# EAGLE design testbrd (EAGLE 7.2.0)
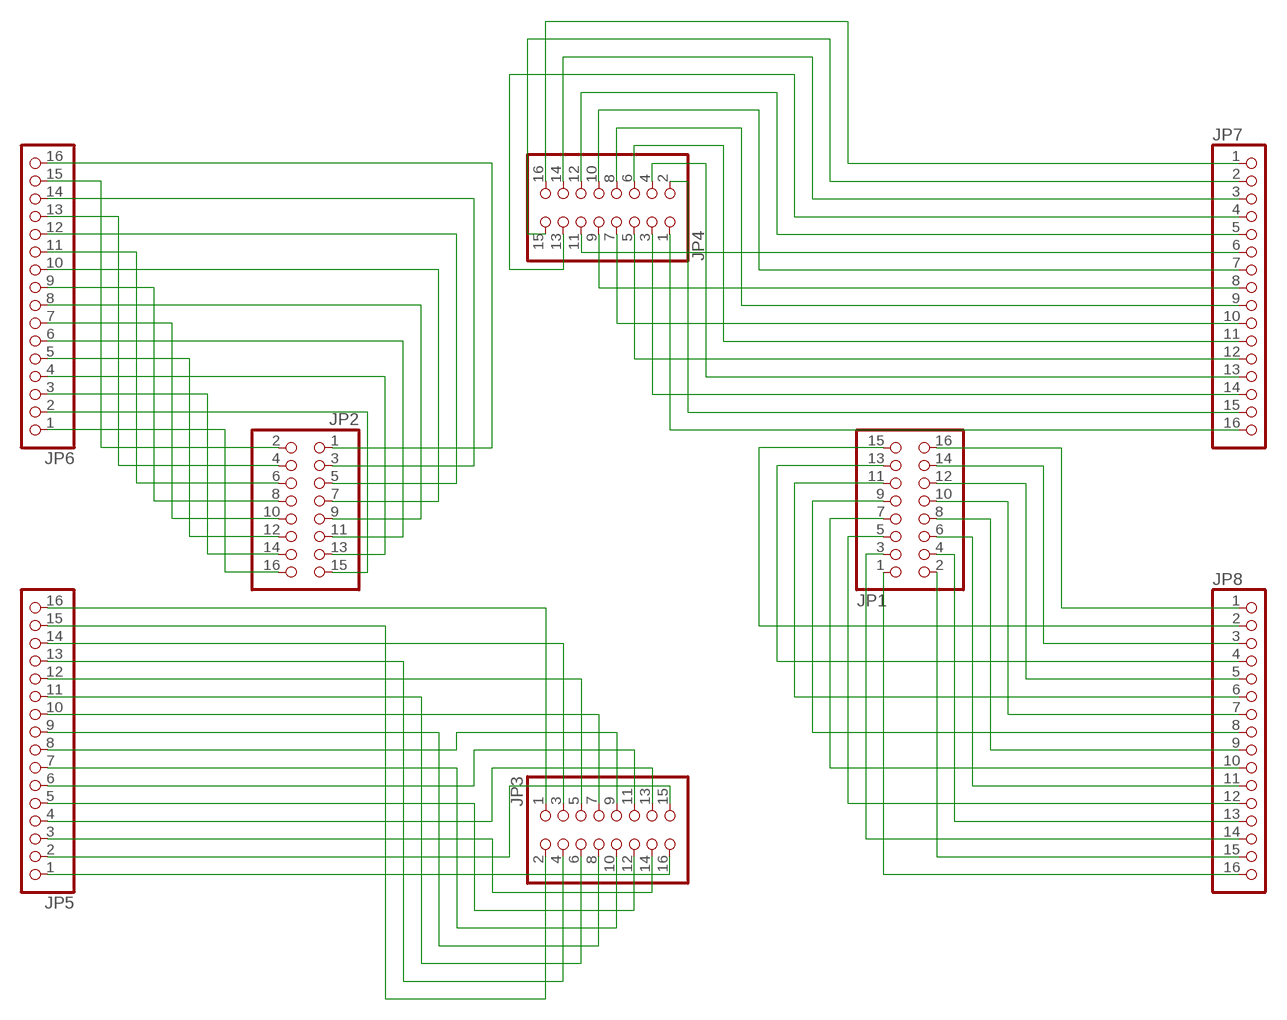
[diagram p0: schematic, sheet 1]

## Parts
JP1  PINHD-2X8  [2X08]
JP2  PINHD-2X8  [2X08]
JP3  PINHD-2X8  [2X08]
JP4  PINHD-2X8  [2X08]
JP5  PINHD-1X16  [1X16]
JP6  PINHD-1X16  [1X16]
JP7  PINHD-1X16  [1X16]
JP8  PINHD-1X16  [1X16]

## Nets
N$1: JP2.16 JP6.1
N$2: JP2.15 JP6.2
N$3: JP2.14 JP6.3
N$4: JP2.13 JP6.4
N$5: JP2.12 JP6.5
N$6: JP2.11 JP6.6
N$7: JP2.10 JP6.7
N$8: JP2.9 JP6.8
N$9: JP2.8 JP6.9
N$10: JP2.7 JP6.10
N$11: JP2.6 JP6.11
N$12: JP2.5 JP6.12
N$13: JP2.4 JP6.13
N$14: JP2.3 JP6.14
N$15: JP2.2 JP6.15
N$16: JP2.1 JP6.16
N$17: JP3.16 JP5.1
N$18: JP3.15 JP5.2
N$19: JP3.14 JP5.3
N$20: JP3.13 JP5.4
N$21: JP3.12 JP5.5
N$22: JP3.11 JP5.6
N$23: JP3.10 JP5.7
N$24: JP3.9 JP5.8
N$25: JP3.8 JP5.9
N$26: JP3.7 JP5.10
N$27: JP3.6 JP5.11
N$28: JP3.5 JP5.12
N$29: JP3.4 JP5.13
N$30: JP3.3 JP5.14
N$31: JP3.2 JP5.15
N$32: JP3.1 JP5.16
N$33: JP1.1 JP8.16
N$34: JP1.2 JP8.15
N$35: JP1.3 JP8.14
N$36: JP1.4 JP8.13
N$37: JP1.5 JP8.12
N$38: JP1.6 JP8.11
N$39: JP1.7 JP8.10
N$40: JP1.8 JP8.9
N$41: JP1.9 JP8.8
N$42: JP1.10 JP8.7
N$43: JP1.11 JP8.6
N$44: JP1.12 JP8.5
N$45: JP1.13 JP8.4
N$46: JP1.14 JP8.3
N$47: JP1.15 JP8.2
N$48: JP1.16 JP8.1
N$49: JP4.1 JP7.16
N$50: JP4.2 JP7.15
N$51: JP4.3 JP7.14
N$52: JP4.4 JP7.13
N$53: JP4.5 JP7.12
N$54: JP4.6 JP7.11
N$55: JP4.7 JP7.10
N$56: JP4.8 JP7.9
N$57: JP4.9 JP7.8
N$58: JP4.10 JP7.7
N$59: JP4.11 JP7.6
N$60: JP4.12 JP7.5
N$61: JP4.13 JP7.4
N$62: JP4.14 JP7.3
N$63: JP4.15 JP7.2
N$64: JP4.16 JP7.1

## Library data of the parts
JP1-JP4 = pinhead:PINHD-2X8: PIN HEADER
JP5-JP8 = pinhead:PINHD-1X16: PIN HEADER

## Board
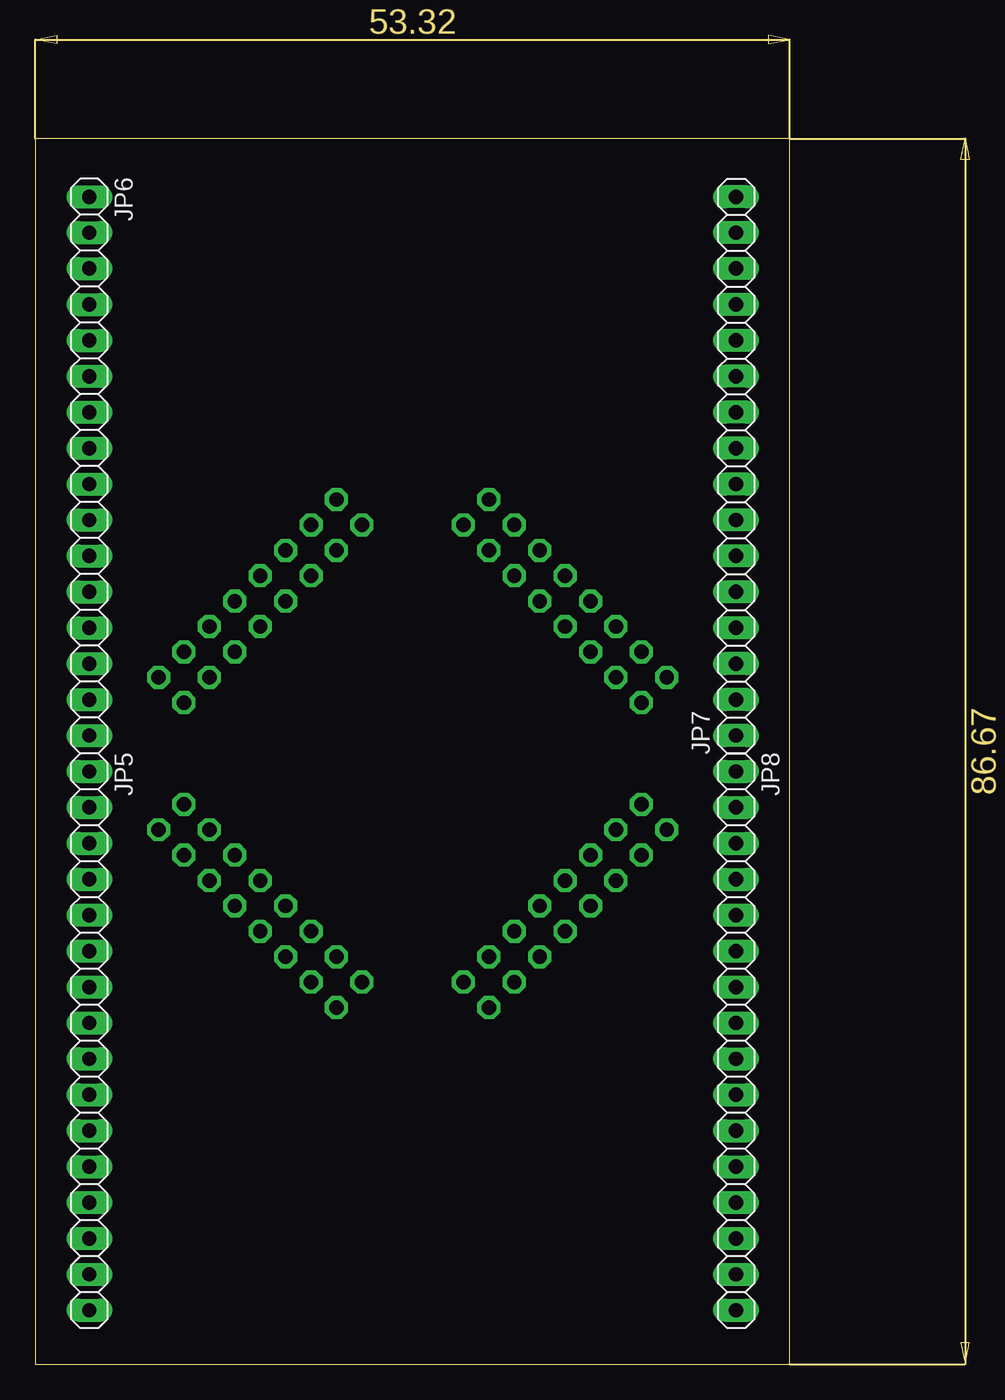
[diagram p1: board, top side]
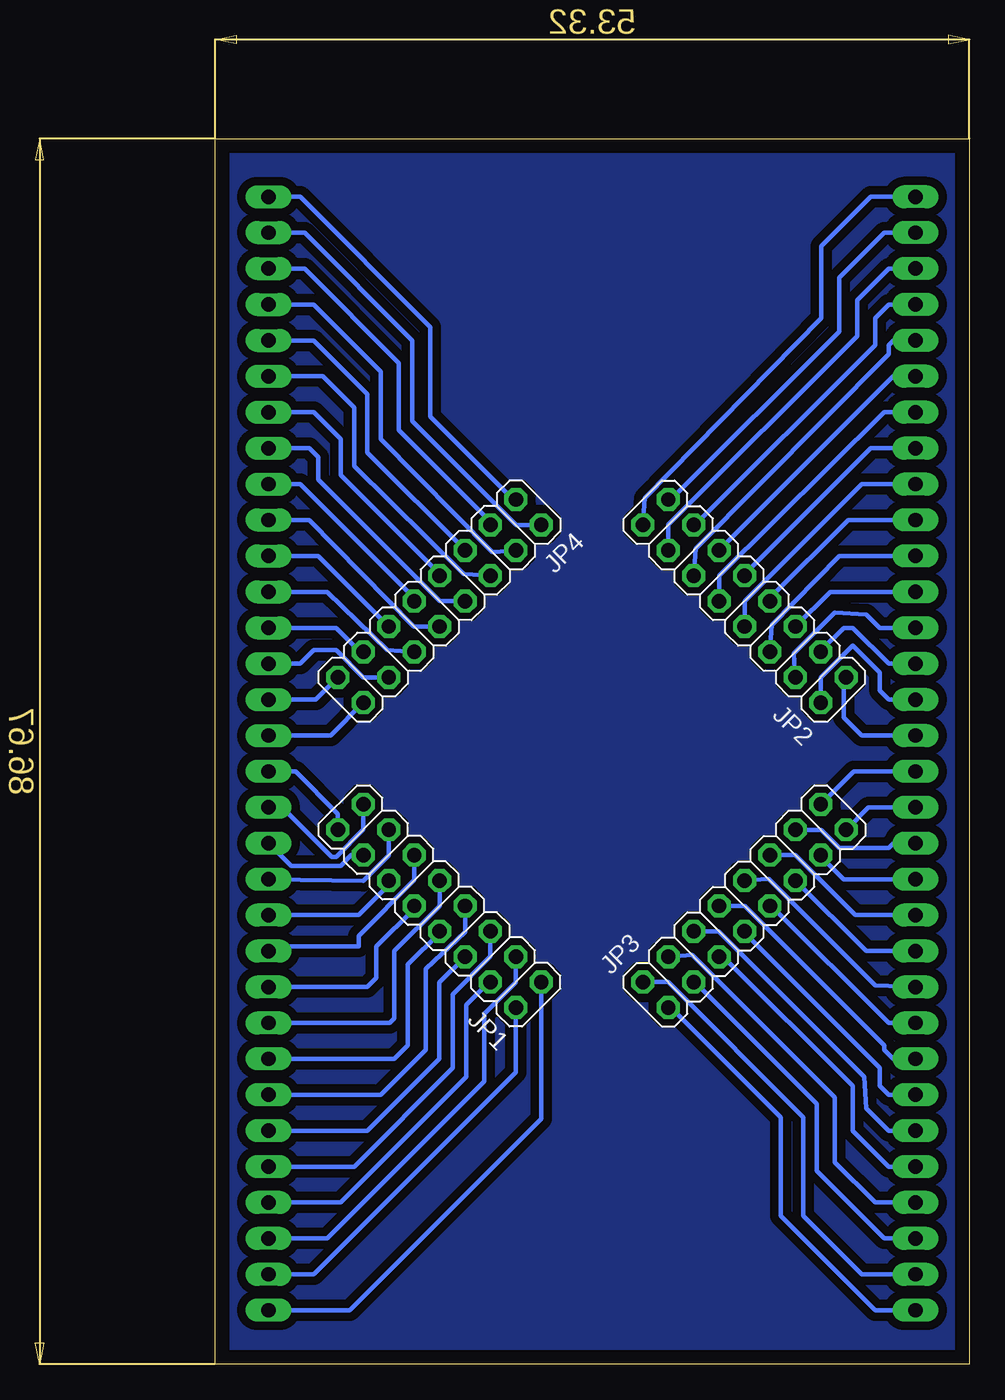
[diagram p2: board, bottom side, seen from below]

Size 53.32 x 86.67 mm. Coordinates in mm from the lower left corner, seen from the top.
Outline: 0,0 53.32,0 53.32,86.67 0,86.67 0,0
Copper layers (1*16): Top 0.035mm / dielectric 1.5mm / Bottom 0.035mm
Design rules "default *": minimum track width 10mil, minimum drill 24mil, track to track 8mil, track to pad 8mil, pad to pad 8mil, via to via 8mil, smd to smd 8mil, copper to edge 40mil, drill to drill 8mil, minimum pad ring 12mil, minimum via ring 8mil, stop-mask expansion 4mil, vias tented up to drill 0mil, thermal gap 10mil

### Footprints (pad centres in the part's own frame; a part is rotated, then mirrored left to right if it is on the bottom)
2X08 = drill 1.016 octagon: 1 -8.89,-1.27; 2 -8.89,1.27; 3 -6.35,-1.27; 4 -6.35,1.27; 5 -3.81,-1.27; 6 -3.81,1.27; 7 -1.27,-1.27; 8 -1.27,1.27; 9 1.27,-1.27; 10 1.27,1.27; 11 3.81,-1.27; 12 3.81,1.27; 13 6.35,-1.27; 14 6.35,1.27; 15 8.89,-1.27; 16 8.89,1.27
1X16 = drill 1.016 long: 1 -19.05,0; 2 -16.51,0; 3 -13.97,0; 4 -11.43,0; 5 -8.89,0; 6 -6.35,0; 7 -3.81,0; 8 -1.27,0; 9 1.27,0; 10 3.81,0; 11 6.35,0; 12 8.89,0; 13 11.43,0; 14 13.97,0; 15 16.51,0; 16 19.05,0

### Placement (x,y rotation side)
JP1  37.45,32.4 135 bottom
JP2  15.89,53.96 135 bottom
JP3  15.89,32.4 45 bottom
JP4  37.45,53.96 225 bottom
JP5  3.81,22.86 270 top
JP6  3.81,63.5 270 top
JP7  49.53,63.5 90 top
JP8  49.53,22.86 270 top

### Tracks (layer width: path | path; a pad name or v marks a point on that pad's centre or on a via)
N$1
  Bottom 0.305: JP2.16 22.95,61.25 10.48,73.98 10.48,79.06 6.99,82.55 JP6.1
N$2
  Bottom 0.305: JP2.15 21.09,61.14 9.21,73.03 9.21,76.83 6.03,80.01 JP6.2
N$3
  Bottom 0.305: JP2.14 21.28,59.36 7.94,72.71 7.94,75.25 5.71,77.47 JP6.3
N$4
  Bottom 0.305: JP2.13 19.4,59.34 6.67,72.07 6.67,73.98 5.71,74.93 JP6.4
N$5
  Bottom 0.305: JP2.12 19.36,57.67 5.71,71.44 5.71,72.07 5.4,72.39 JP6.5
N$6
  Bottom 0.305: JP2.11 5.4,69.85 JP6.6
N$7
  Bottom 0.305: JP2.10 17.69,55.78 6.03,67.31 JP6.7
N$8
  Bottom 0.305: JP2.9 15.89,55.86 6.99,64.77 JP6.8
N$9
  Bottom 0.305: JP2.8 15.89,53.96 7.62,62.23 JP6.9
N$10
  Bottom 0.305: JP2.7 14.1,54.16 8.57,59.69 JP6.10
N$11
  Bottom 0.305: JP2.6 13.97,52.26 9.21,57.15 JP6.11
N$12
  Bottom 0.305: JP2.5 9.84,54.61 JP6.12
N$13
  Bottom 0.305: JP2.4 12.43,50.25 9.53,53.15 7.3,53.02 6.35,52.07 JP6.13
N$14
  Bottom 0.305: JP2.3 10.51,50.45 8.89,52.07 8.26,52.07 5.71,49.53 JP6.14
N$15
  Bottom 0.305: JP2.2 10.51,48.55 8.26,50.8 6.35,48.9 6.35,47.62 5.71,46.99 JP6.15
N$16
  Bottom 0.305: JP6.16 7.62,44.45 8.89,45.72 8.89,48.39 JP2.1
N$17
  Bottom 0.305: JP3.16 8.18,41.91 JP5.1
N$18
  Bottom 0.305: JP3.15 7.13,39.37 JP5.2
N$19
  Bottom 0.305: JP3.14 10.49,37.79 9.21,36.51 5.71,36.51 5.4,36.83 JP5.3
N$20
  Bottom 0.305: JP3.13 10.51,35.91 8.89,34.29 JP5.4
N$21
  Bottom 0.305: JP3.12 12.31,36 8.06,31.75 JP5.5
N$22
  Bottom 0.305: JP3.11 7.3,29.21 JP5.6
N$23
  Bottom 0.305: JP3.10 14.2,34.33 6.67,26.8 JP5.7
N$24
  Bottom 0.305: JP3.9 13.99,32.4 5.71,24.13 JP5.8
N$25
  Bottom 0.305: JP3.8 15.89,32.4 6.03,22.54 6.03,22.23 5.4,21.59 JP5.9
N$26
  Bottom 0.305: JP3.7 15.89,30.5 6.35,20.95 6.35,19.68 5.71,19.05 JP5.10
N$27
  Bottom 0.305: JP3.6 17.72,30.61 7.43,20.32 7.3,18.1 5.71,16.51 JP5.11
N$28
  Bottom 0.305: JP3.5 17.38,28.81 8.26,19.68 8.26,16.51 5.71,13.97 JP5.12
N$29
  Bottom 0.305: JP3.4 19.6,28.94 9.53,18.86 9.53,14.29 6.67,11.43 JP5.13
N$30
  Bottom 0.305: JP3.3 19.4,27.02 10.79,18.41 10.79,13.65 6.03,8.89 JP5.14
N$31
  Bottom 0.305: JP3.2 21.3,27.02 11.75,17.46 11.75,10.48 7.62,6.35 JP5.15
N$32
  Bottom 0.305: JP3.1 21.09,25.22 13.34,17.46 13.34,10.48 6.67,3.81 JP5.16
N$33
  Bottom 0.305: JP1.1 30.26,17.36 43.81,3.81 JP8.16
N$34
  Bottom 0.305: JP1.2 32.06,20.65 46.35,6.35 JP8.15
N$35
  Bottom 0.305: JP1.3 32.06,27 34.29,24.77 34.29,20 45.4,8.89 JP8.14
N$36
  Bottom 0.305: JP1.4 33.94,27.02 35.56,25.4 35.56,20.32 44.45,11.43 JP8.13
N$37
  Bottom 0.305: JP1.5 33.85,28.82 36.51,26.16 36.51,20.95 43.5,13.97 JP8.12
N$38
  Bottom 0.305: JP1.6 37.47,26.99 37.47,21.59 42.55,16.51 JP8.11
N$39
  Bottom 0.305: JP1.7 35.65,30.58 38.42,27.94 38.42,22.23 41.59,19.05 JP8.10
N$40
  Bottom 0.305: JP1.8 37.45,30.5 39.69,28.26 39.69,22.54 40.64,21.59 JP8.9
N$41
  Bottom 0.305: JP1.9 37.45,32.4 40.64,29.21 40.64,24.45 40.96,24.13 JP8.8
N$42
  Bottom 0.305: JP1.10 39.24,32.2 41.91,29.53 41.91,27.3 42.55,26.67 JP8.7
N$43
  Bottom 0.305: JP1.11 39.24,34.23 43.18,30.29 43.18,29.53 49.21,29.53 JP8.6
N$44
  Bottom 0.305: JP1.12 41.04,33.89 43.18,31.75 JP8.5
N$45
  Bottom 0.305: JP1.13 41.04,35.99 42.86,34.16 JP8.4
N$46
  Bottom 0.305: JP1.14 43.7,36 44.45,35.24 47.94,35.24 JP8.3
N$47
  Bottom 0.305: JP1.15 42.83,37.81 44.77,35.88 45.09,35.88 48.58,39.37 JP8.2
N$48
  Bottom 0.305: JP1.16 44.63,38.92 47.62,41.91 JP8.1
N$49
  Bottom 0.305: JP4.1 32.25,61.14 38.1,66.99 38.1,73.34 47.31,82.55 JP7.16
N$50
  Bottom 0.305: JP4.2 32.04,59.34 39.37,66.67 39.37,72.39 46.99,80.01 JP7.15
N$51
  Bottom 0.305: JP4.3 33.85,59.57 40.32,66.04 40.32,70.8 46.99,77.47 JP7.14
N$52
  Bottom 0.305: JP4.4 33.74,57.42 41.59,65.41 41.59,70.17 46.35,74.93 JP7.13
N$53
  Bottom 0.305: JP4.5 42.55,64.45 42.55,68.58 46.35,72.39 JP7.12
N$54
  Bottom 0.305: JP4.6 35.75,55.88 43.5,63.5 43.5,67.63 45.72,69.85 JP7.11
N$55
  Bottom 0.305: JP4.7 37.45,55.86 44.45,62.87 44.45,65.41 46.35,67.31 JP7.10
N$56
  Bottom 0.305: JP4.8 37.45,53.96 46.04,62.55 46.04,64.14 46.67,64.77 JP7.9
N$57
  Bottom 0.305: JP4.9 39.24,54.16 47.31,62.23 JP7.8
N$58
  Bottom 0.305: JP4.10 39.27,52.16 46.67,59.69 JP7.7
N$59
  Bottom 0.305: JP4.11 46.04,57.15 JP7.6
N$60
  Bottom 0.305: JP4.12 41.16,50.49 45.4,54.61 JP7.5
N$61
  Bottom 0.305: JP4.13 43.06,50.36 44.77,52.07 JP7.4
N$62
  Bottom 0.305: JP4.14 42.85,48.57 44.77,50.48 46.35,50.48 47.31,49.53 JP7.3
N$63
  Bottom 0.305: JP4.15 46.21,46.99 JP7.2
N$64
  Bottom 0.305: JP4.16 45.16,44.45 JP7.1
N$65
  pour Bottom (isolate 0.61): 0,86.36 53.34,86.36 53.34,0 0,0

### Text on the board
tValues: 1 | 64 | 2 | 63 | 3 | 62 | 4 | 61 | 5 | 60 | 6 | 59 | 7 | 58 | 8 | 57 | 9 | 56 | 10 | 55 | 11 | 54 | 12 | 53 | 13 | 52 | 16 | 49 | 17 | 48 | 20 | 45 | 21 | 44 | 22 | 43 | 23 | 42 | 24 | 41 | 25 | 40 | 26 | 39 | 27 | 38 | 28 | 37 | 29 | 36 | 30 | 35 | 31 | 34 | 32 | 33